# Altium schematic sheet 1 Motherboard connector.SchDoc
size 420 x 297 mm; SheetNumber: 2; SheetTotal: 9
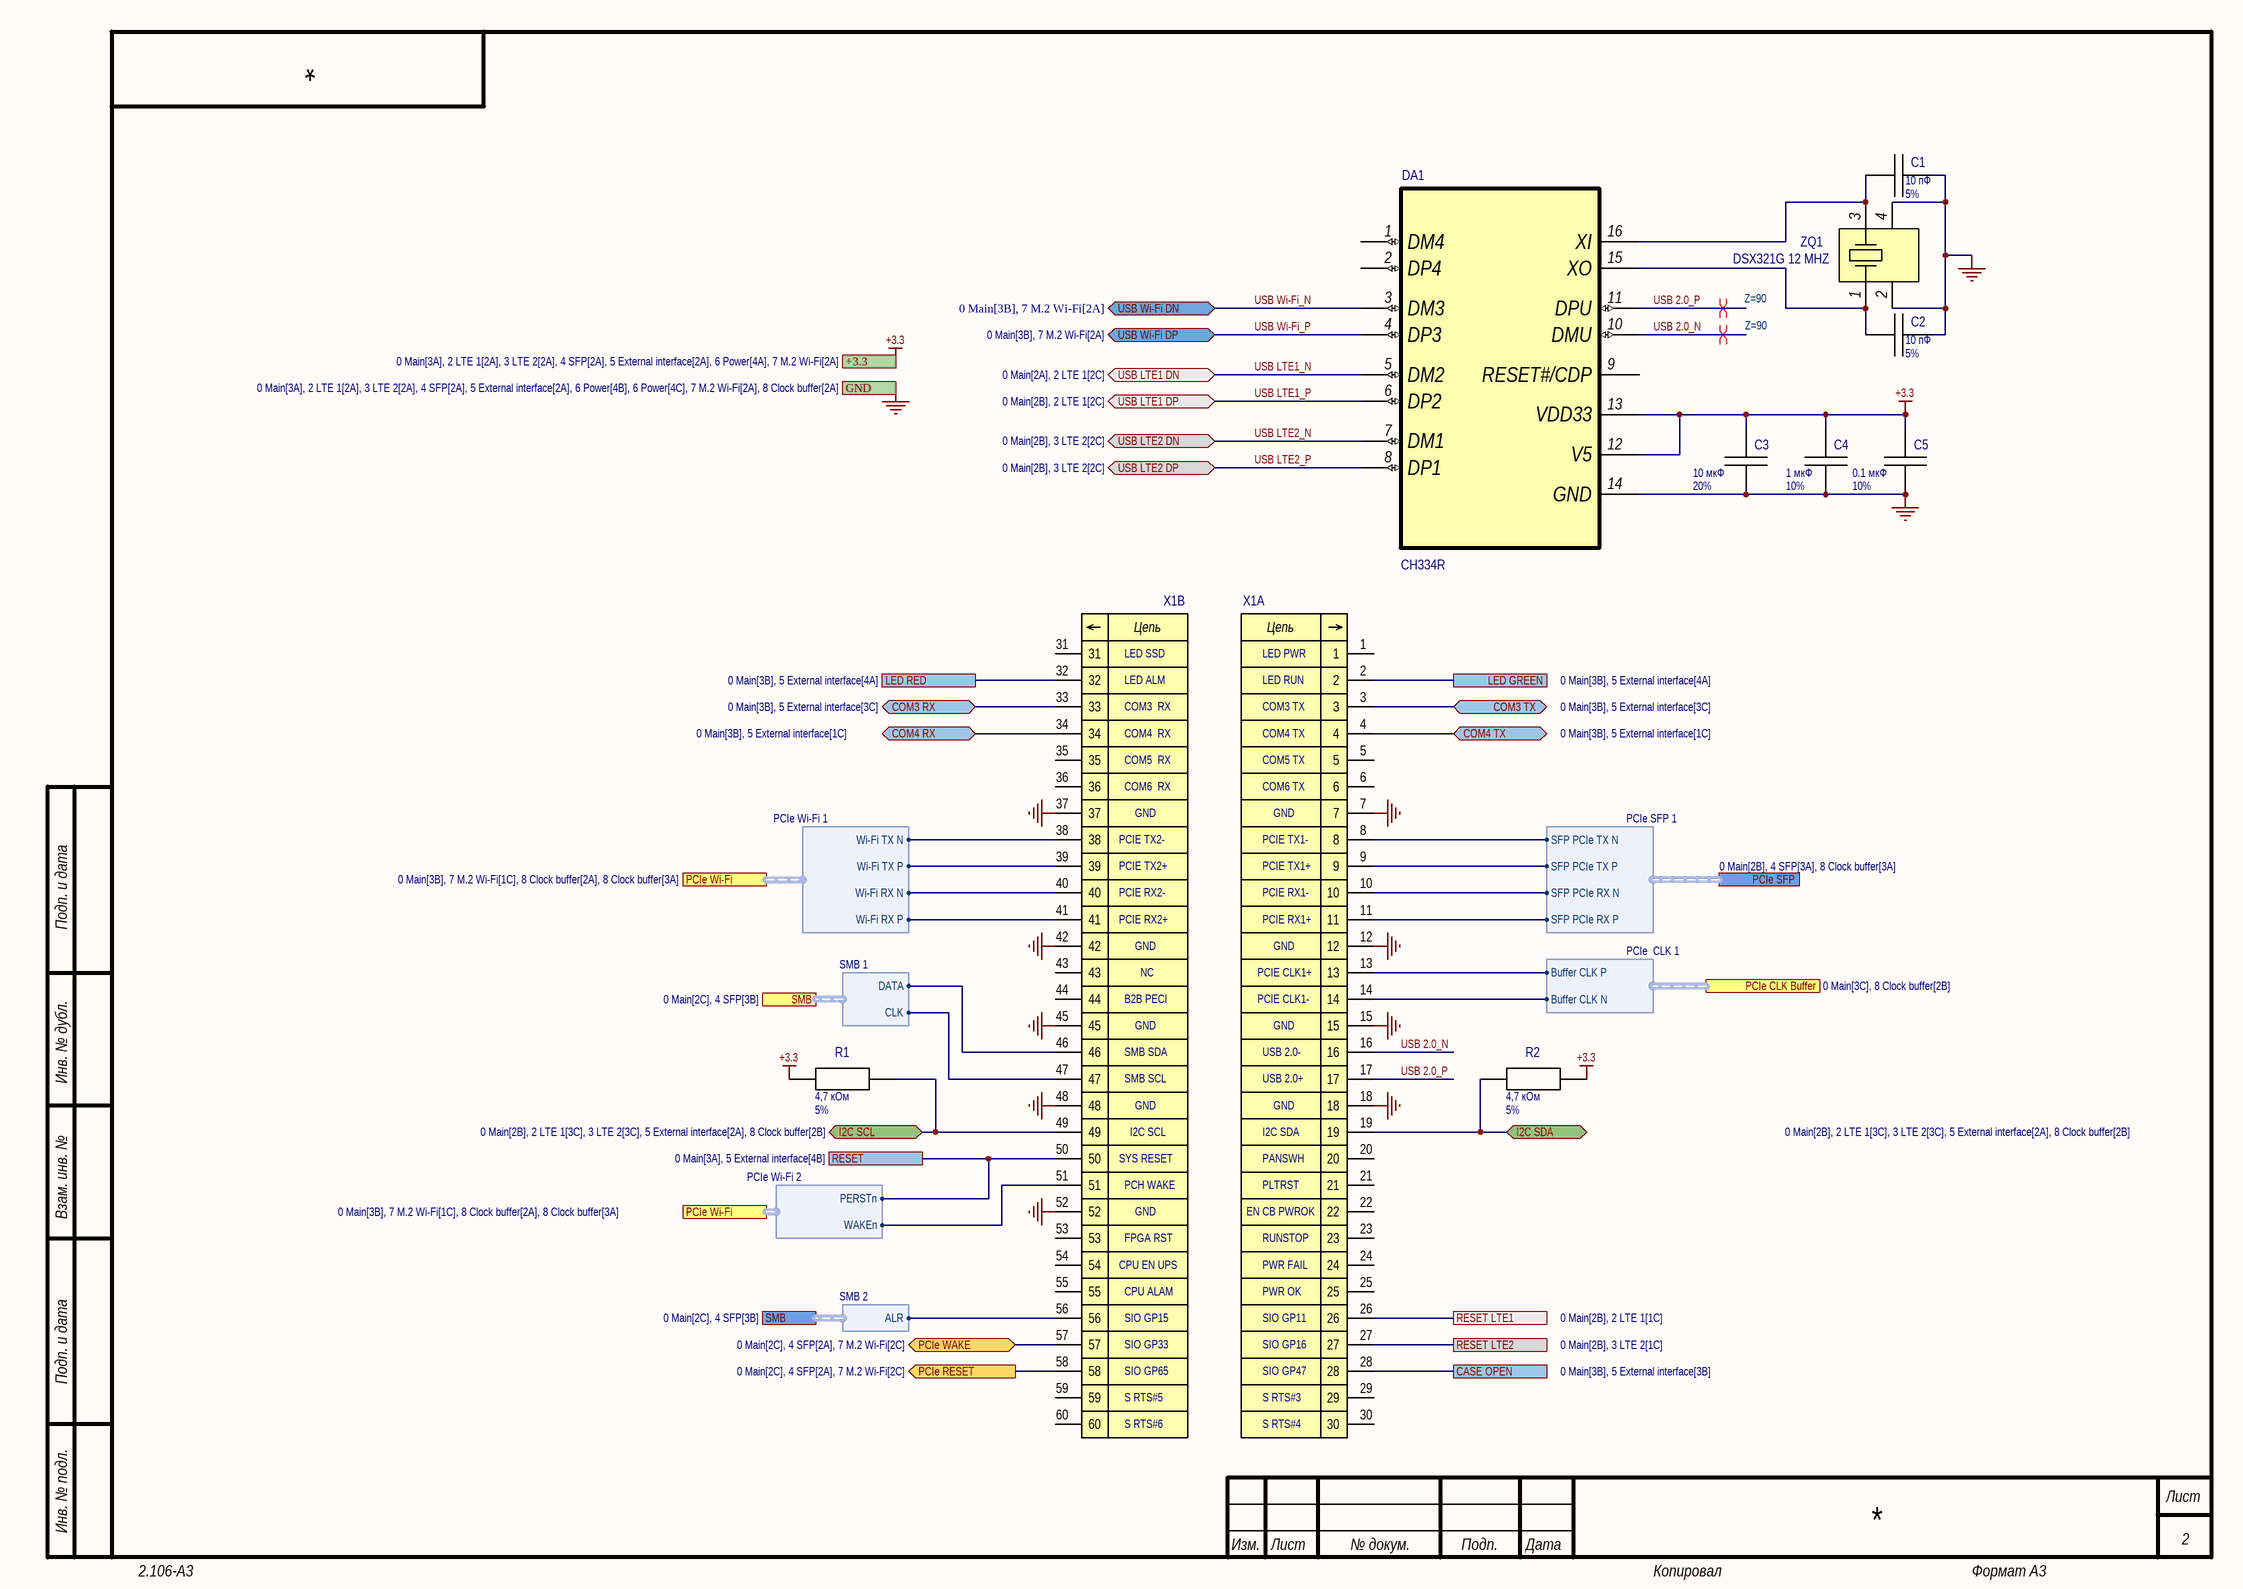
[diagram p0: 1 Motherboard connector.SchDoc]

## Parts
C1  value 10 пФ  Tolerance: 5%  [CAP_0402]
C2  value 10 пФ  Tolerance: 5%  [CAP_0402]
C3  value 10 мкФ  Tolerance: 20%  [CAP_0402_BIG]
C4  value 1 мкФ  Tolerance: 10%  [CAP_0402]
C5  value 0.1 мкФ  Tolerance: 10%  [CAP_0402]
DA1  CH334R  [QSOP-16]
R1  value 4,7 кОм  Tolerance: 5%  [RES_0402]  (hidden comment: STD_RES)
R2  value 4,7 кОм  Tolerance: 5%  [RES_0402]  (hidden comment: STD_RES)
X1  123053-606050-HF  [123053-606050-HF]  (value not drawn)  (parts A,B of 2)
ZQ1  DSX321G 12 MHZ  [3,5x2,5]

## Ports
+3.3 (see 0 Main[3A], 2 LTE 1[2A], 3 LTE 2[2A], 4 SFP[2A], 5 External interface[2A], 6 Power[4A], 7 M.2 Wi-Fi[2A]), CASE OPEN (see 0 Main[3B], 5 External interface[3B]), COM3 RX (bidir, see 0 Main[3B], 5 External interface[3C]), COM3 TX (bidir, see 0 Main[3B], 5 External interface[3C]), COM4 RX (bidir, see 0 Main[3B], 5 External interface[1C]), COM4 TX (bidir, see 0 Main[3B], 5 External interface[1C]), GND (see 0 Main[3A], 2 LTE 1[2A], 3 LTE 2[2A], 4 SFP[2A], 5 External interface[2A], 6 Power[4B], 6 Power[4C], 7 M.2 Wi-Fi[2A], 8 Clock buffer[2A]), I2C SCL (bidir, see 0 Main[2B], 2 LTE 1[3C], 3 LTE 2[3C], 5 External interface[2A], 8 Clock buffer[2B]), I2C SDA (bidir, see 0 Main[2B], 2 LTE 1[3C], 3 LTE 2[3C], 5 External interface[2A], 8 Clock buffer[2B]), LED GREEN (see 0 Main[3B], 5 External interface[4A]), LED RED (see 0 Main[3B], 5 External interface[4A]), PCIe CLK Buffer (harness PCIe  CLK 1, see 0 Main[3C], 8 Clock buffer[2B]), PCIe RESET (out, see 0 Main[2C], 4 SFP[2A], 7 M.2 Wi-Fi[2C]), PCIe SFP (harness PCIe SFP 1, see 0 Main[2B], 4 SFP[3A], 8 Clock buffer[3A]), PCIe WAKE (bidir, see 0 Main[2C], 4 SFP[2A], 7 M.2 Wi-Fi[2C]), PCIe Wi-Fi (harness PCIe Wi-Fi 1, see 0 Main[3B], 7 M.2 Wi-Fi[1C], 8 Clock buffer[2A], 8 Clock buffer[3A]), PCIe Wi-Fi (harness PCIe Wi-Fi 2, see 0 Main[3B], 7 M.2 Wi-Fi[1C], 8 Clock buffer[2A], 8 Clock buffer[3A]), RESET (see 0 Main[3A], 5 External interface[4B]), RESET LTE1 (see 0 Main[2B], 2 LTE 1[1C]), RESET LTE2 (see 0 Main[2B], 3 LTE 2[1C]), SMB (harness SMB 1, see 0 Main[2C], 4 SFP[3B]), SMB (harness SMB 2, see 0 Main[2C], 4 SFP[3B]), USB LTE1 DN (bidir, see 0 Main[2A], 2 LTE 1[2C]), USB LTE1 DP (bidir, see 0 Main[2B], 2 LTE 1[2C]), USB LTE2 DN (bidir, see 0 Main[2B], 3 LTE 2[2C]), USB LTE2 DP (bidir, see 0 Main[2B], 3 LTE 2[2C]), USB Wi-Fi DN (bidir, see 0 Main[3B], 7 M.2 Wi-Fi[2A]), USB Wi-Fi DP (bidir, see 0 Main[3B], 7 M.2 Wi-Fi[2A])

## Harnesses
SMB 1: DATA, CLK
SMB 2: ALR
PCIe Wi-Fi 1: Wi-Fi TX P, Wi-Fi TX N, Wi-Fi RX P, Wi-Fi RX N
PCIe Wi-Fi 2: WAKEn, PERSTn
PCIe  CLK 1: Buffer CLK P, Buffer CLK N
PCIe SFP 1: SFP PCIe RX P, SFP PCIe RX N, SFP PCIe TX P, SFP PCIe TX N

## Nets
+3.3: C3.1 C4.1 C5.1 DA1.12(V5) DA1.13(VDD33) R1.2 R2.2 ; port +3.3
GND: C1.2 C2.2 C3.2 C4.2 C5.2 DA1.14(GND) X1.7 X1.12 X1.15 X1.18 X1.37 X1.42 X1.45 X1.48 X1.52 ZQ1.2 ZQ1.4 ; port GND
CASE OPEN: X1.28 ; port CASE OPEN
COM3 RX: X1.33 ; port COM3 RX
COM3 TX: X1.3 ; port COM3 TX
COM4 RX: X1.34 ; port COM4 RX
COM4 TX: X1.4 ; port COM4 TX
I2C SCL: R1.1 X1.49 ; port I2C SCL
I2C SDA: R2.1 X1.19 ; port I2C SDA
LED GREEN: X1.2 ; port LED GREEN
LED RED: X1.32 ; port LED RED
PCIe RESET: X1.58 ; port PCIe RESET
PCIe WAKE: X1.57 ; port PCIe WAKE
RESET: X1.50 ; port RESET, port PCIe Wi-Fi.PERSTn
RESET LTE1: X1.26 ; port RESET LTE1
RESET LTE2: X1.27 ; port RESET LTE2
USB 2.0_N: DA1.10(DMU) X1.16
USB 2.0_P: DA1.11(DPU) X1.17
USB LTE1_N: DA1.5(DM2) ; port USB LTE1 DN
USB LTE1_P: DA1.6(DP2) ; port USB LTE1 DP
USB LTE2_N: DA1.7(DM1) ; port USB LTE2 DN
USB LTE2_P: DA1.8(DP1) ; port USB LTE2 DP
USB Wi-Fi_N: DA1.3(DM3) ; port USB Wi-Fi DN
USB Wi-Fi_P: DA1.4(DP3) ; port USB Wi-Fi DP
NetC1_1: C1.1 DA1.16(XI) ZQ1.3
NetC2_1: C2.1 DA1.15(XO) ZQ1.1
NetX1_8: X1.8 ; port PCIe SFP.SFP PCIe TX N
NetX1_9: X1.9 ; port PCIe SFP.SFP PCIe TX P
NetX1_10: X1.10 ; port PCIe SFP.SFP PCIe RX N
NetX1_11: X1.11 ; port PCIe SFP.SFP PCIe RX P
NetX1_13: X1.13 ; port PCIe CLK Buffer.Buffer CLK P
NetX1_14: X1.14 ; port PCIe CLK Buffer.Buffer CLK N
NetX1_38: X1.38 ; port PCIe Wi-Fi.Wi-Fi TX N
NetX1_39: X1.39 ; port PCIe Wi-Fi.Wi-Fi TX P
NetX1_40: X1.40 ; port PCIe Wi-Fi.Wi-Fi RX N
NetX1_41: X1.41 ; port PCIe Wi-Fi.Wi-Fi RX P
NetX1_46: X1.46 ; port SMB.DATA
NetX1_47: X1.47 ; port SMB.CLK
NetX1_51: X1.51 ; port PCIe Wi-Fi.WAKEn
NetX1_56: X1.56 ; port SMB.ALR

Not connected (* = marked no-connect by the designer): DA1 1(DM4) 2(DP4) 9(RESET#/CDP); X1 1 5 6 20 21 22 23 24 25 29 30 31 35 36 43 44 53 54 55 59 60

## Layout directives
differential pair; differential pair class Z=90: USB 2.0_N, USB 2.0_P

## Notes on the sheet
- (near X1) LED SSD
- (near X1) LED PWR
- (near X1) LED ALM
- (near X1) COM3  RX
- (near X1) LED RUN
- (near X1) COM3 TX
- (near X1) COM4  RX
- (near X1) COM5  RX
- (near X1) COM6  RX
- (near X1) COM4 TX
- (near X1) COM5 TX
- (near X1) COM6 TX
- (near X1) PCIE TX2-
- (near X1) PCIE TX2+
- (near X1) GND
- (near X1) PCIE TX1-
- (near X1) PCIE TX1+
- GND
- (near X1) PCIE RX2-
- (near X1) PCIE RX2+
- (near X1) PCIE RX1-
- (near X1) PCIE RX1+
- (near X1) B2B PECI
- NC
- (near X1) PCIE CLK1+
- (near X1) PCIE CLK1-
- (near X1) SMB SDA
- (near X1) USB 2.0-
- (near X1) SMB SCL
- (near X1) I2C SCL
- (near X1) USB 2.0+
- (near X1) I2C SDA
- (near X1) SYS RESET
- (near X1) PCH WAKE
- (near X1) PANSWH
- (near X1) PLTRST
- (near X1) CPU EN UPS
- (near X1) FPGA RST
- (near X1) EN CB PWROK
- (near X1) RUNSTOP
- (near X1) PWR FAIL
- (near X1) CPU ALAM
- (near X1) SIO GP15
- (near X1) PWR OK
- (near X1) SIO GP11
- (near X1) SIO GP33
- (near X1) SIO GP65
- (near X1) S RTS#5
- (near X1) SIO GP16
- (near X1) SIO GP47
- (near X1) S RTS#3
- (near X1) S RTS#6
- (near X1) S RTS#4
- Подп. и дата
- Инв. № дубл.
- Взам. инв. №
- Инв. № подл.
- Изм.
- Лист
- № докум.
- Подп.
- Дата
- 2.106-A3
- Копировал
- Формат А3
- (in symbol 123053-606050-HF, part A) Цепь
- (in symbol 123053-606050-HF, part B) Цепь

## Library data of the parts
C1 C2 = CC0402JRNPO9BN100: Конденсатор CHIP-0402 10 пФ 50 В 5% NPO; Manufacturer: YAGEO; ID: 86; Напряжение: 50 В; Температура: -55...+85°C; Autor: Цислав А.Н.; PartNumber: CC0402JRNPO9BN100; Type: CHIP-0402; Диэлектрик: NPO; Data: 09-05-2013
C3 = CC0402MRX5R5BB106: Конденсатор CHIP-0402 10 мкФ 6.3 В 20% X5R; Manufacturer: YAGEO; ID: 340; Напряжение: 6.3 В; Температура: -55...+85°C; Autor: Admin; PartNumber: CC0402MRX5R5BB106; Type: CHIP-0402; Диэлектрик: X5R; Data: 02-12-2025
C4 = GRM155R61E105KA12D: Конденсатор CHIP-0402 1 мкФ 25 В 10% X5R; Manufacturer: YAGEO; ID: 337; Напряжение: 25 В; Температура: -55...+85°C; Autor: Admin; PartNumber: GRM155R61E105KA12D; Type: CHIP-0402; Диэлектрик: X5R; Data: 10-30-2023
C5 = CC0402KRX7R7BB104: Конденсатор CHIP-0402 0.1 мкФ 16 В 10% X7R; Manufacturer: YAGEO; ID: 26; Напряжение: 16 В; Температура: -55...+85°C; Autor: Admin; PartNumber: CC0402KRX7R7BB104; Type: CHIP-0402; Диэлектрик: X7R; Data: 08-29-2013
DA1 = CH334R: Микросхема WCH USB HUB  1-4 port; ID: 746; Voltage: 5В; Current: 50 мА; Температура: -40...+85°C; Autor: Admin; PartNumber: CH334R; Type: Interfaces; Value: USB HUB  1-4 port; Manufacturer: WCH; Data: 04-23-2024
R1 R2 = RC0402JR-074K7L: Резистор CHIP-0402 4,7 кОм 5%; Manufacturer: YAGEO; ID: 382; ТКС: 100 ppm/K; Температура: -55...+155°C; Autor: Цислав А.Н.; PartNumber: RC0402JR-074K7L; Type: CHIP-0402; Data: 02-03-2014
X1 = 123053-606050-HF: Разъем BEIJIDA ELECTRONICS TECHNOLOGY Board-to-Board; ID: 480; Contact: 60; Pitch: 0.5 мм; Current: 1 А; Autor: Admin; PartNumber: 123053-606050-HF; Type: Board-to-Board; Mounting: Поверхностный; Manufacturer: BEIJIDA ELECTRONICS TECHNOLOGY; Data: 08-11-2025
ZQ1 = DSX321G 12 MHZ: Микросхема KSE   Quartz Cristal 12.0 MHz ±30ppm; ID: 739; Температура: -40...+85°C; Autor: Admin; PartNumber: DSX321G 12 MHZ; Type: Clocks; Value: Quartz Cristal 12.0 MHz ±30ppm; Voltage: -; Current: -; Manufacturer: KSE; Data: 05-03-2024